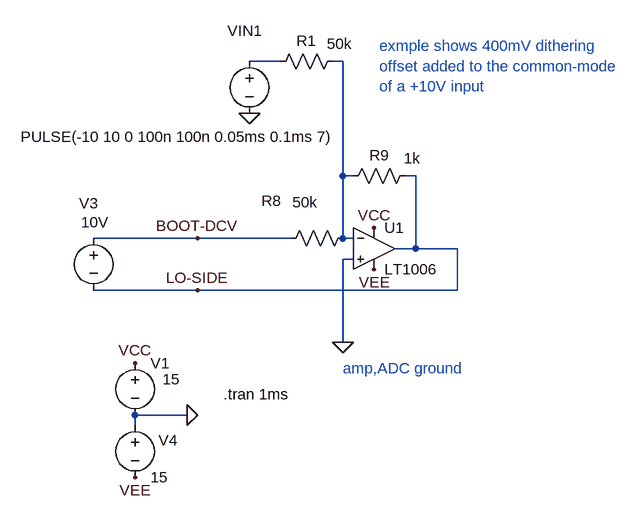
[diagram p0: schematic Draft05.asc]
Draft05.asc, the LTspice schematic file:
Version 4
SHEET 1 2756 2104
WIRE -464 -832 -512 -832
WIRE -368 -832 -384 -832
WIRE -368 -656 -368 -832
WIRE -352 -656 -368 -656
WIRE -256 -656 -272 -656
WIRE -592 -560 -752 -560
WIRE -448 -560 -592 -560
WIRE -368 -560 -368 -656
WIRE -352 -560 -368 -560
WIRE -256 -544 -256 -656
WIRE -256 -544 -288 -544
WIRE -192 -544 -256 -544
WIRE -352 -528 -368 -528
WIRE -592 -480 -752 -480
WIRE -192 -480 -192 -544
WIRE -192 -480 -592 -480
WIRE -368 -400 -368 -528
WIRE -608 -288 -688 -288
WIRE -688 -272 -688 -288
FLAG -688 -368 VCC
FLAG -688 -192 VEE
FLAG -608 -288 0
FLAG -320 -576 VCC
FLAG -320 -512 VEE
FLAG -368 -400 0
FLAG -592 -480 LO-SIDE
FLAG -592 -560 BOOT-DCV
FLAG -512 -752 0
SYMBOL voltage -688 -384 R0
WINDOW 123 0 0 Left 0
WINDOW 39 0 0 Left 0
WINDOW 3 42 41 Left 2
SYMATTR Value 15
SYMATTR InstName V1
SYMBOL voltage -688 -288 R0
WINDOW 123 0 0 Left 0
WINDOW 39 0 0 Left 0
WINDOW 0 36 39 Left 2
SYMATTR InstName V4
SYMATTR Value 15
SYMBOL OpAmps\\LT1006 -320 -608 R0
SYMATTR InstName U1
SYMBOL voltage -752 -576 R0
WINDOW 123 0 0 Left 0
WINDOW 39 0 0 Left 0
WINDOW 3 -19 -9 Left 2
WINDOW 0 -22 -38 Left 2
SYMATTR Value 10V
SYMATTR InstName V3
SYMBOL res -464 -544 R270
WINDOW 0 58 -14 VTop 2
WINDOW 3 87 38 VBottom 2
SYMATTR InstName R8
SYMATTR Value 50k
SYMBOL res -368 -640 R270
WINDOW 0 32 56 VTop 2
WINDOW 3 59 107 VBottom 2
SYMATTR InstName R9
SYMATTR Value 1k
SYMBOL voltage -512 -848 R0
WINDOW 123 0 0 Left 0
WINDOW 39 0 0 Left 0
WINDOW 3 -352 132 Left 2
WINDOW 0 -34 -31 Left 2
SYMATTR Value PULSE(-10 10 0 100n 100n 0.05ms 0.1ms 7)
SYMATTR InstName VIN1
SYMBOL res -480 -816 R270
WINDOW 0 32 56 VTop 2
WINDOW 3 59 107 VBottom 2
SYMATTR InstName R1
SYMATTR Value 50k
TEXT -552 -320 Left 2 !.tran 1ms
TEXT -312 -856 Left 2 ;exmple shows 400mV dithering \noffset added to the common-mode\nof a +10V input
TEXT -368 -360 Left 2 ;amp,ADC ground

The netlist it stands for:
* Draft05.asc
V1 VCC 0 15
V4 0 VEE 15
XU1 0 N002 VCC VEE LO-SIDE LT1006  ; pins In+ In- V+ V- OUT
V3 BOOT-DCV LO-SIDE 10V
R8 BOOT-DCV N002 50k
R9 N002 LO-SIDE 1k
VIN1 N001 0 PULSE(-10 10 0 100n 100n 0.05ms 0.1ms 7)
R1 N001 N002 50k
.tran 1ms
* exmple shows 400mV dithering
* offset added to the common-mode
* of a +10V input
* amp,ADC ground
.lib LTC.lib
.backanno
.end